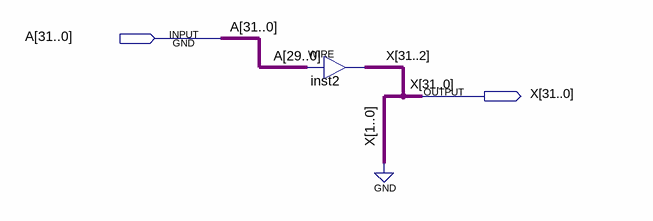
[diagram p0: schematic sheet]
// Quartus schematic shft2l32.bdf as structural Verilog: 1 symbols, 2 pins
module shft2l32 (
  input  [31:0] A,
  output [31:0] X
);

  assign X[31:2] = A[29:0];  // WIRE inst2

  assign X[1:0] = 2'b00;
endmodule
